# EasyEDA Pro project transmitter by chandan.eprj

# Schematic Transmitter
Board Name: Transmitter; Create Date: 2025-07-05; Page Name: transmitter by poojit; Project Name: transmitter by chandan; Schematic Name: Transmitter; Update Date: 2025-07-13; Add into BOM: yes; Company: Your Company; Convert to PCB: yes; Date: 2025-10-25; Draw By: chandan; REV: 1.0; Sheet: 1/1; spicePre: .
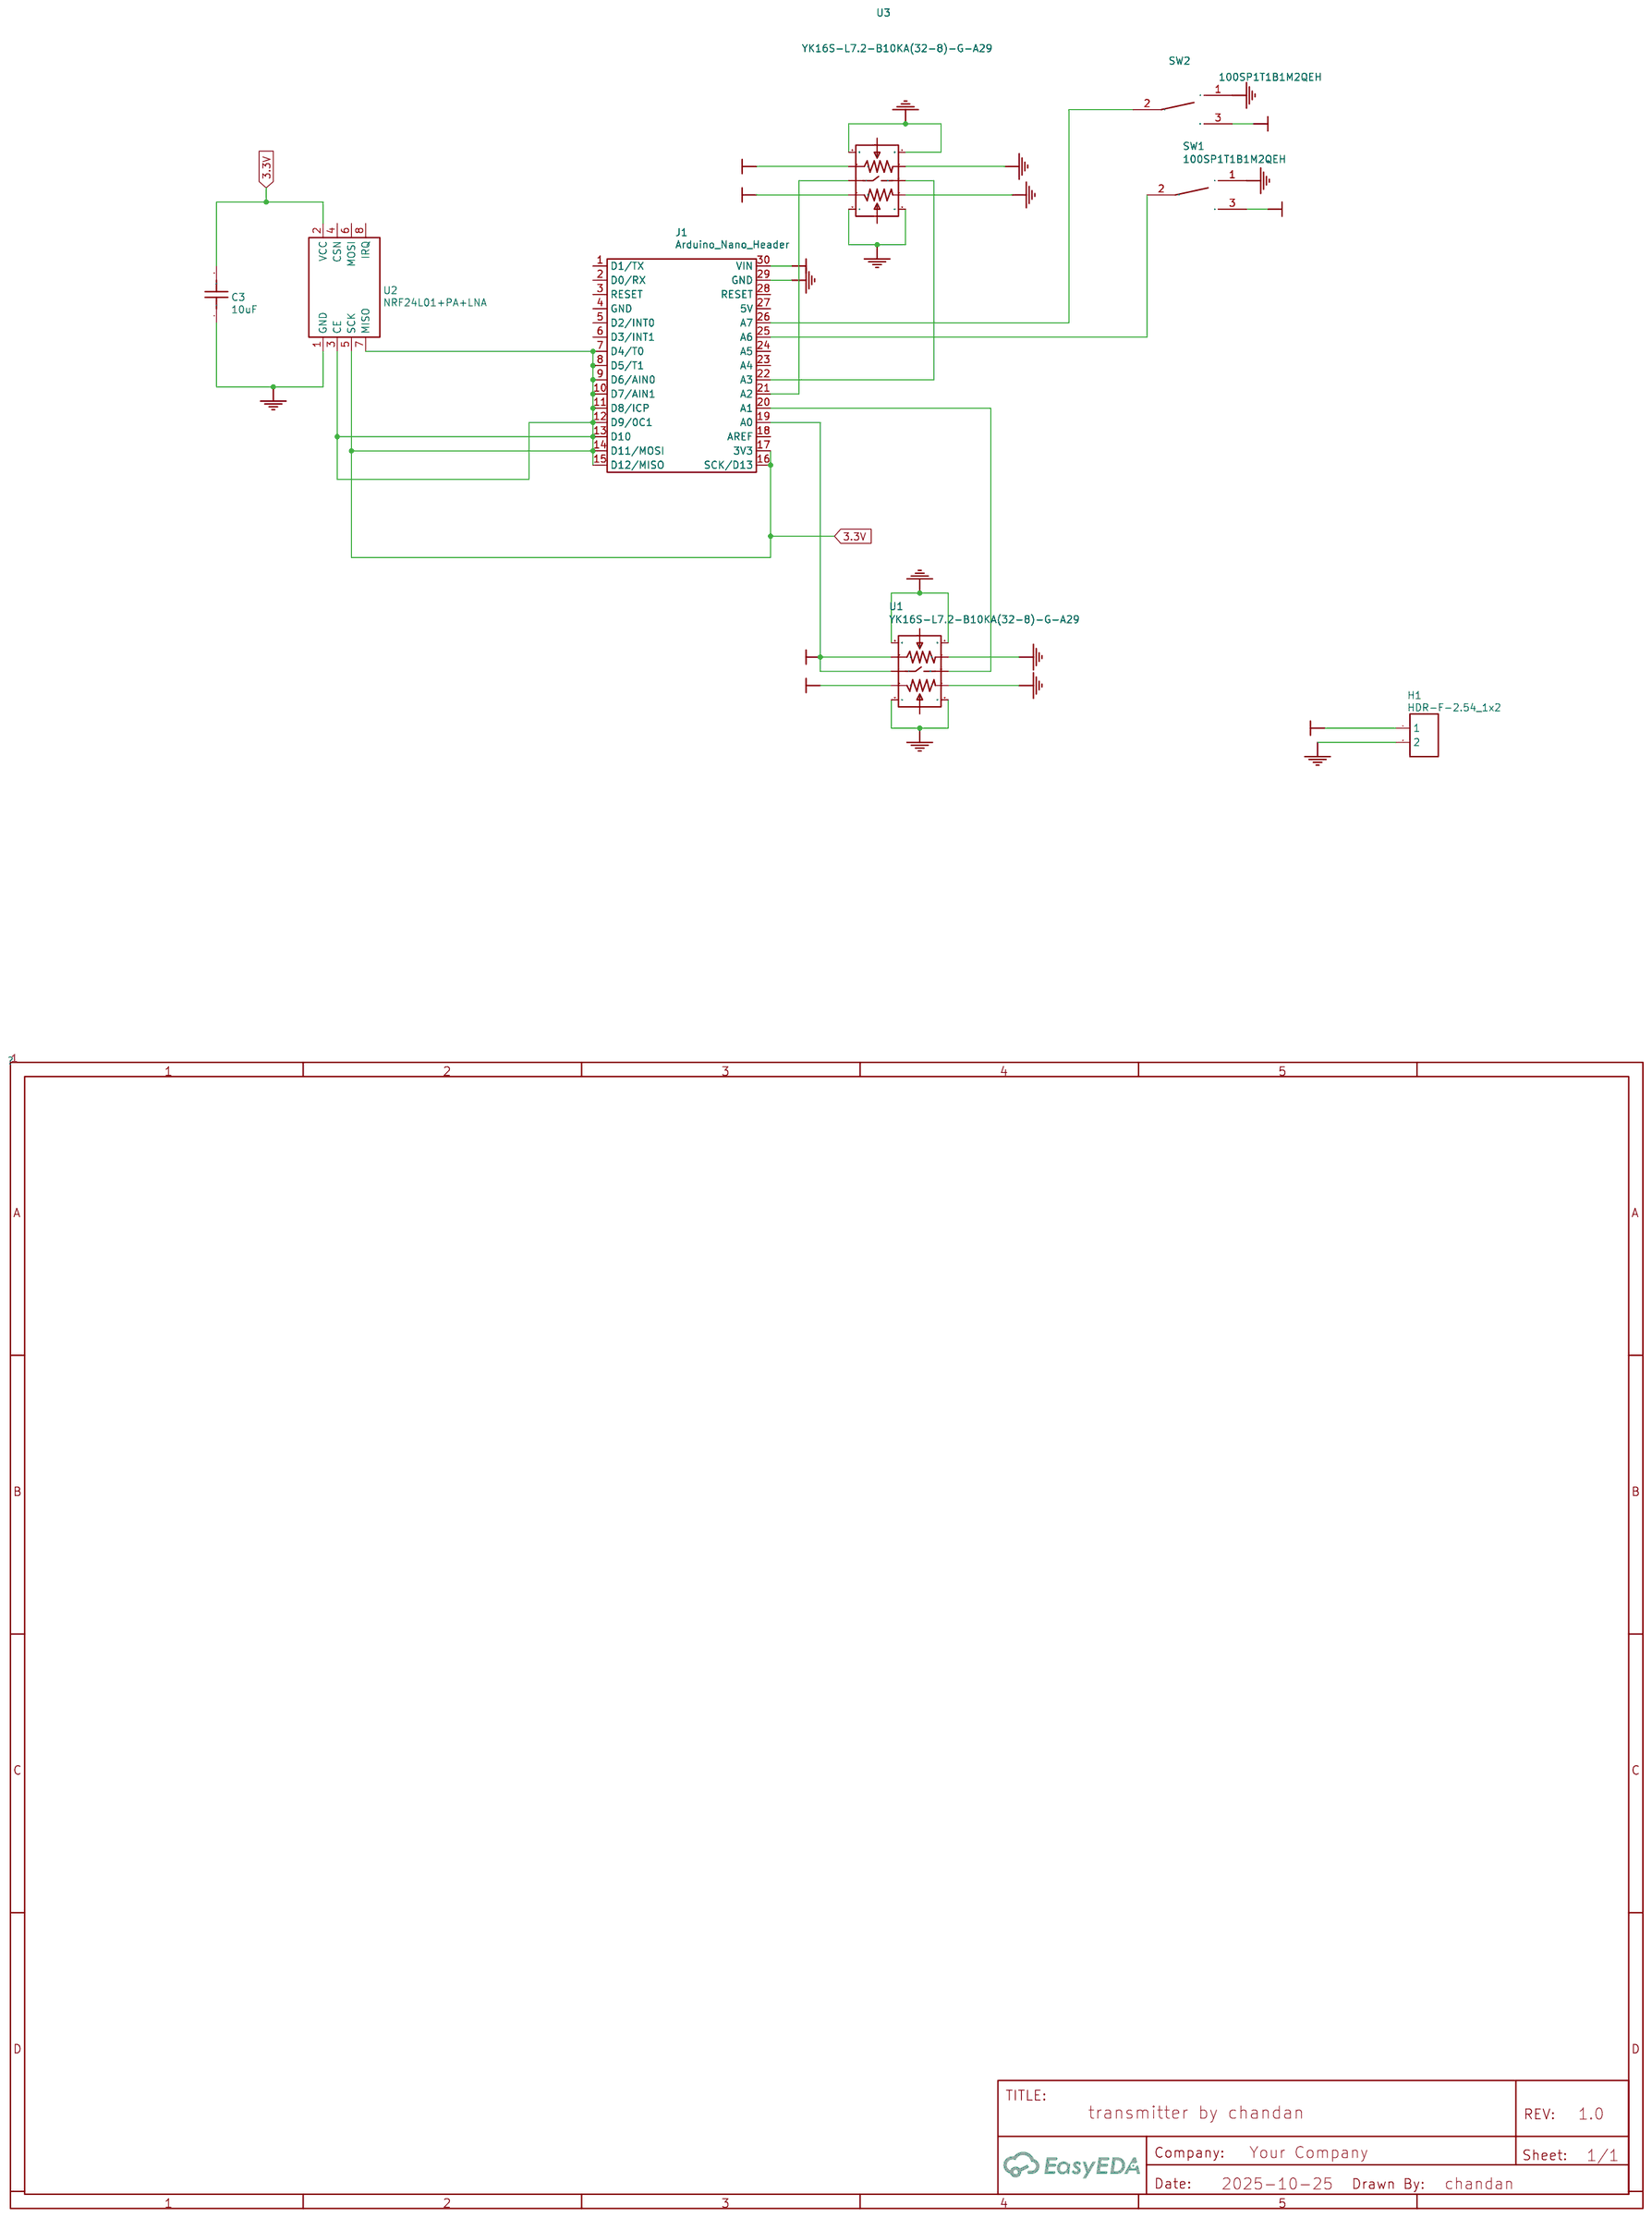
[diagram p0: schematic sheet]

## Parts
C3  10uF
H1  HDR-F-2.54_1x2
J1  Arduino_Nano_Header
SW1  100SP1T1B1M2QEH
SW2  100SP1T1B1M2QEH
U1  YK16S-L7.2-B10KA(32-8)-G-A29
U2  NRF24L01+PA+LNA
U3  YK16S-L7.2-B10KA(32-8)-G-A29

## Library data of the parts
C3 = 10uF: Supplier: LCSC; Supplier Part: C3694130; Manufacturer: TDK; Manufacturer Part: FK16X5R1H105K; Contributor: lcsc; nameAlias: Value; spicePre: C; spiceSymbolName: FK16X5R1H105K
H1 = HDR-F-2.54_1x2: Supplier Part: C49661; Supplier: LCSC; Contributor: LCEDA_Lib; spicePre: H
J1 = Arduino_Nano_Header: spicePre: J
SW1 SW2 = 100SP1T1B1M2QEH: Supplier: LCSC; Supplier Part: C273351; Manufacturer: E-Switch; JLCPCB Part Class: Extended Part; Contributor: LCSC; spicePre: S
U1 U3 = YK16S-L7.2-B10KA(32-8)-G-A29: Supplier: LCSC; Supplier Part: C37323746; Manufacturer: YTL(亚特联); Manufacturer Part: YK16S-L7.2-B10Ka(32-8)-G-A29; JLCPCB Part Class: Extended Part; Contributor: lcsc; spicePre: U
U2 = NRF24L01+PA+LNA: Supplier: LCSC; Supplier Part: C9900187674; Manufacturer: null; Manufacturer Part: nRF24L01+PA+LNA; JLCPCB Part Class: Extended Part; Contributor: lcsc; spicePre: U

## Nets
3.3V: C3.2 J1.7(D4/T0) J1.8(D5/T1) J1.9(D6/AIN0) J1.10(D7/AIN1) J1.11(D8/ICP) J1.12(D9/0C1) J1.13(D10) J1.14(D11/MOSI) J1.15(D12/MISO) J1.16(SCK/D13) J1.17(3V3) U2.2(VCC) U2.3(CE) U2.5(SCK) U2.7(MISO)
+5V: H1.1 J1.19(A0) J1.30(VIN) SW1.3 SW2.3 U1.3 U1.6 U1.7 U3.3 U3.6
GND: C3.1 H1.2 J1.29(GND) SW1.1 SW2.1 U1.1 U1.4 U1.9(shell) U1.10(shell) U1.11(shell) U1.12(shell) U2.1(GND) U3.1 U3.4 U3.9(shell) U3.10(shell) U3.11(shell) U3.12(shell)
Net-(J1-20): J1.20(A1) U1.8
Net-(J1-21): J1.21(A2) U3.7
Net-(J1-22): J1.22(A3) U3.8
Net-(J1-25): J1.25(A6) SW1.2
Net-(J1-26): J1.26(A7) SW2.2

Not connected (* = marked no-connect by the designer): J1 1(D1/TX) 2(D0/RX) 3(RESET) 4(GND) 5(D2/INT0) 6(D3/INT1) 18(AREF) 23(A4) 24(A5) 27(5V) 28(RESET); U1 2 5; U2 4(CSN) 6(MOSI) 8(IRQ); U3 2 5

# Board transmitter by chandan
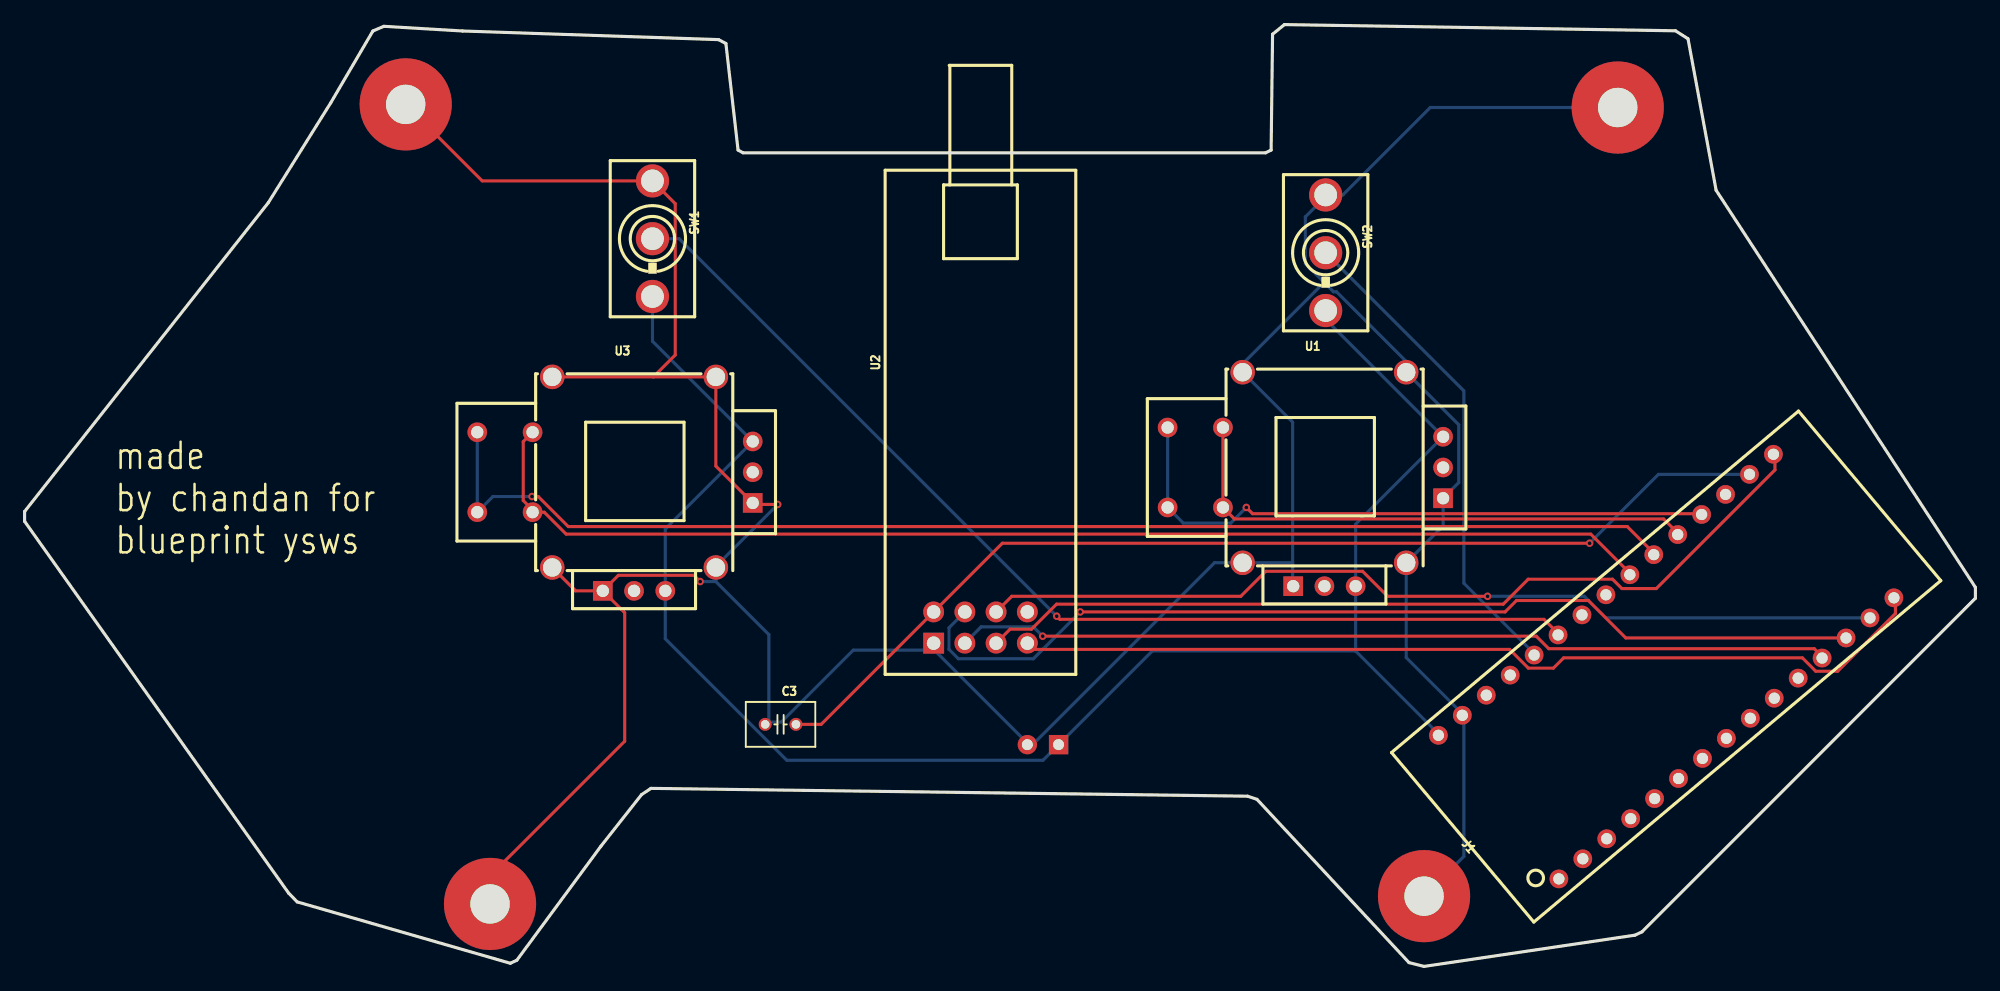
[diagram p1: board, top side]
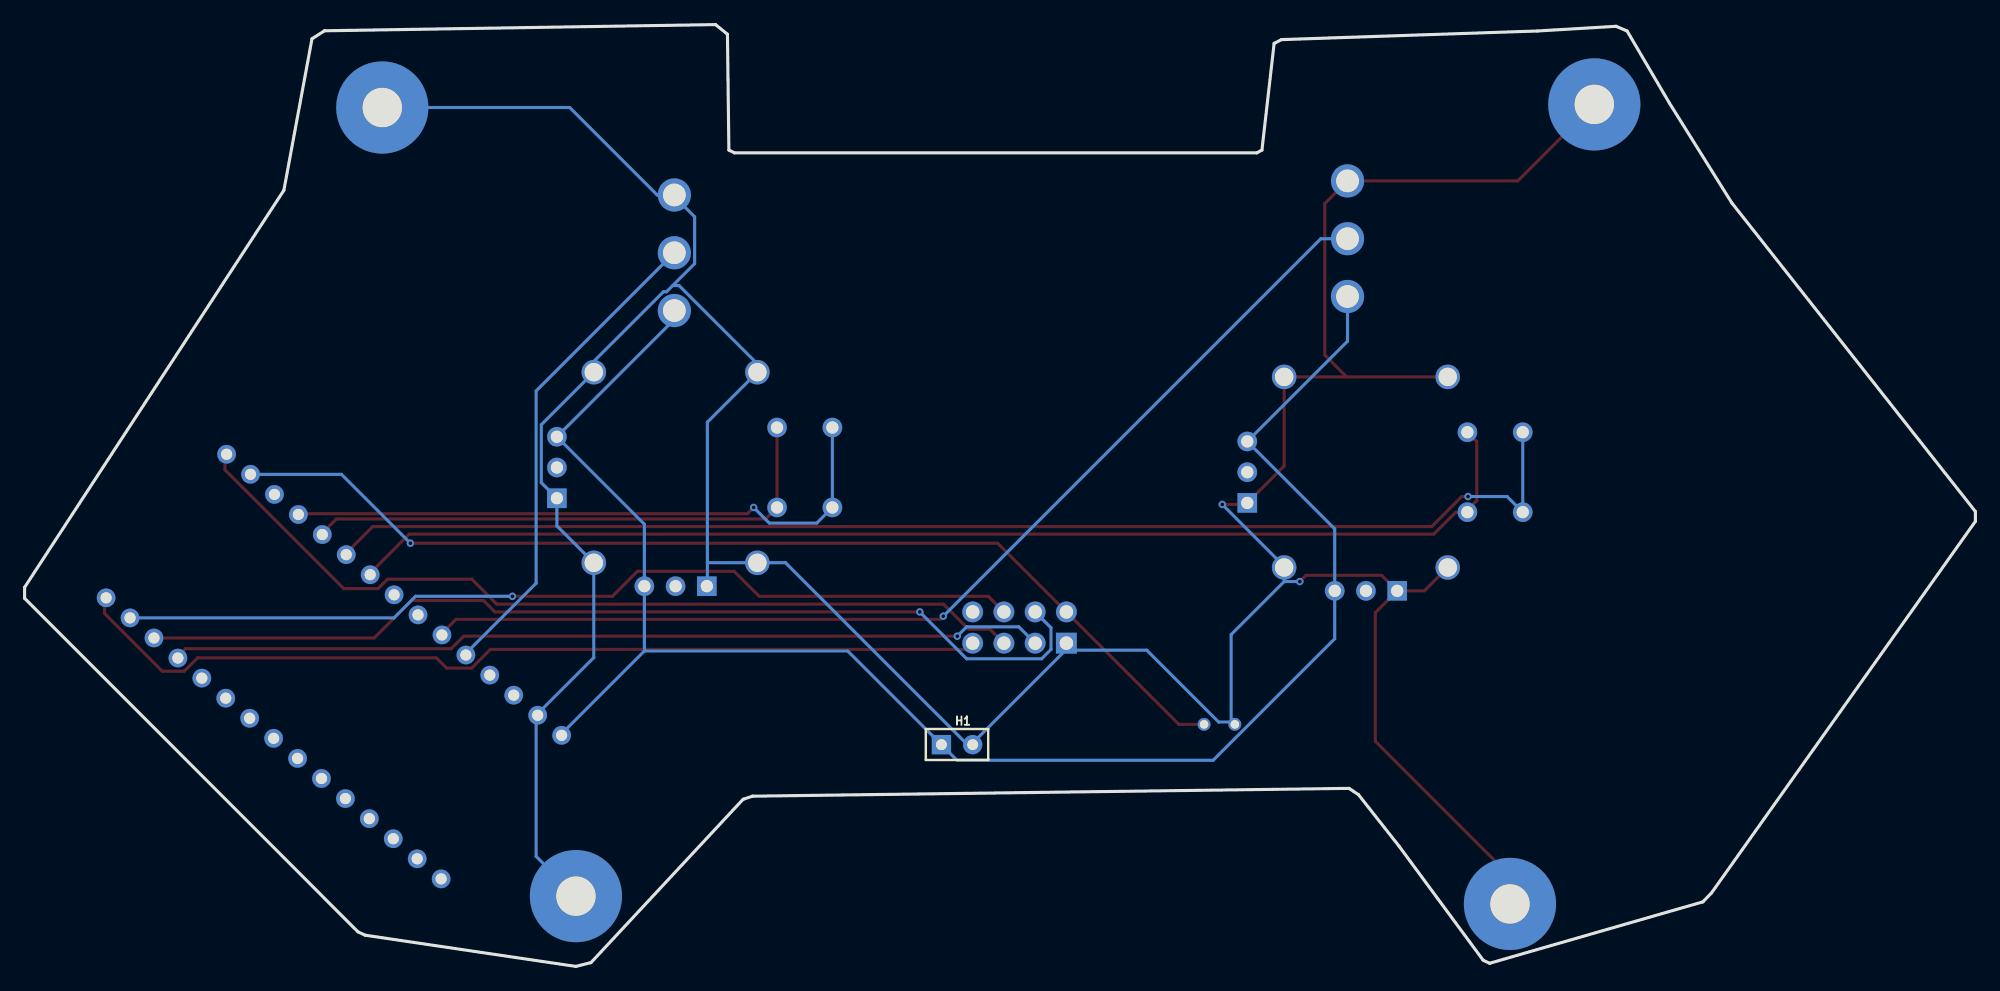
[diagram p2: board, bottom side, seen from below]

Outline 158.62 x 76.59 mm; copper layers: Top Layer, Bottom Layer. Coordinates in mm from the lower left corner of the outline.
Outline path: 0,36.99 0,36.19 21.46,5.97 22.16,5.25 39.5,0.25 40.03,0.5 46.86,9.78 50.16,13.97 50.93,14.48 99.44,13.84 100.2,13.59 112.57,0.31 113.79,0 130.94,2.54 131.51,2.81 158.62,29.94 158.62,30.83 137.54,63.12 135.25,75.44 134.24,76.09 102.44,76.59 101.47,75.81 101.36,66.39 100.91,66.17 58.42,66.17 58.01,66.39 57.02,75.06 56.43,75.37 35.62,76.07 29.21,76.45 28.32,76.07 24.89,70.23 19.81,62.1 0,36.99
Stack: Top Layer 0.035mm / Dielectric1 1.51mm FR4 er 4.5 / Bottom Layer 0.035mm

## Design rules (mm)
spacing Default (default): track to track 0.152, other pairs 0 to 0.152
track width Default (default): min 0.254, default 0.254, max 25.4
differential pair differentialPair (default): width min 0.127, default 0.254, max 2.54; gap min 0.152, default 0.152
via Default (default): diameter min 0.61, default 0.61, max 100.025; hole min 0.305, default 0.305, max 59.995

## Placement (name value [footprint] x y rotation side)
C3  10uF  [CAP-TH_L5.5-W3.5-P2.50-D0.5]  61.47 19.68 0 top
H1  HDR-F-2.54_1x2  [HDR-F-2.54_1X2]  82.8 18.03 180 bottom
J1  Arduino_Nano_Header  [DIP-30_L43.18-W15.24-ARDUINONANO]  133.48 24.38 130 top
NOREF  -  [Pad_e235]  129.54 69.85 0 top
NOREF#2  -  [Pad_e236]  30.99 70.1 0 top
NOREF#3  -  [Pad_e238]  113.79 5.72 0 top
NOREF#4  -  [Pad_e237]  37.85 5.08 0 top
SW1  100SP1T1B1M2QEH  [SW-TH_100SP1T1B1M2QEH]  51.05 59.18 270 top
SW2  100SP1T1B1M2QEH  [SW-TH_100SP1T1B1M2QEH]  105.79 58.04 270 top
U1  YK16S-L7.2-B10KA(32-8)-G-A29  [JOYTICK-TH_YF16S-FL7.2-B5KB-45-10-Y_1]  104.14 39.62 0 top
U2  NRF24L01+PA+LNA  [COMM-TH_L41.0-W15.5-P2.54_NRF24L01]  77.72 27.56 90 top
U3  YK16S-L7.2-B10KA(32-8)-G-A29  [JOYTICK-TH_YF16S-FL7.2-B5KB-45-10-Y_1]  48.01 39.24 0 top

## Footprints (pads in the part's own frame, mm; a bottom-side part is the same pattern mirrored in y, then rotated)
CAP-TH_L5.5-W3.5-P2.50-D0.5
  round 1.05 hole 0.7: 1(-1.25,0) 2(1.25,0)
COMM-TH_L41.0-W15.5-P2.54_NRF24L01
  rect 1.7x1.7 hole 1.1: 1(-1.27,3.81)
  round 1.7 hole 1.1: 2(1.27,3.81) 3(-1.27,1.27) 4(1.27,1.27) 5(-1.27,-1.27) 6(1.27,-1.27) 7(-1.27,-3.81) 8(1.27,-3.81)
DIP-30_L43.18-W15.24-ARDUINONANO
  round 1.524 hole 0.914: 1(-7.62,17.78) 2(-7.62,15.24) 3(-7.62,12.7) 4(-7.62,10.16) 5(-7.62,7.62) 6(-7.62,5.08) 7(-7.62,2.54) 8(-7.62,0) 9(-7.62,-2.54) 10(-7.62,-5.08) 11(-7.62,-7.62) 12(-7.62,-10.16) 13(-7.62,-12.7) 14(-7.62,-15.24) 15(-7.62,-17.78) 16(7.62,-17.78) 17(7.62,-15.24) 18(7.62,-12.7) 19(7.62,-10.16) 20(7.62,-7.62) 21(7.62,-5.08) 22(7.62,-2.54) 23(7.62,0) 24(7.62,2.54) 25(7.62,5.08) 26(7.62,7.62) 27(7.62,10.16) 28(7.62,12.7) 29(7.62,15.24) 30(7.62,17.78)
HDR-F-2.54_1X2
  rect 1.575x1.575 hole 0.889: 1(-1.27,0)
  round 1.575 hole 0.889: 2(1.27,0)
JOYTICK-TH_YF16S-FL7.2-B5KB-45-10-Y_1
  rect 1.6x1.6 hole 1: 1(-0.99,-8.7) 4(11.2,-1.55)
  round 1.6 hole 1: 2(1.55,-8.7) 3(4.09,-8.7) 5(11.2,0.95) 6(11.2,3.45) 7(-11.2,4.2) 7(-11.2,-2.3) 8(-6.7,4.2) 8(-6.7,-2.3)
  round 2 hole 1.5: 9(-5.1,8.7) 10(8.2,8.7) 11(8.2,-6.8) 12(-5.1,-6.8)
Pad_e235
  round 7.5 hole 3.2: 1(0,0)
Pad_e236
  round 7.5 hole 3.2: 1(0,0)
Pad_e237
  round 7.5 hole 3.2: 1(0,0)
Pad_e238
  round 7.5 hole 3.2: 1(0,0)
SW-TH_100SP1T1B1M2QEH
  round 2.7 hole 1.85: 1(-4.7,0) 2(0,0) 3(4.7,0)

## Nets
3.3V: C3.2 J1.17 U2.2
+5V: H1.1 J1.30 SW1.3 SW2.3 U1.3 U1.6 U3.3 U3.6
GND: C3.1 H1.2 J1.29 NOREF.1 NOREF#2.1 NOREF#3.1 NOREF#4.1 SW1.1 SW2.1 U1.1 U1.4 U1.9 U1.10 U1.11 U1.12 U2.1 U3.1 U3.4 U3.9 U3.10 U3.11 U3.12
J1_1: J1.1
J1_2: J1.2
J1_3: J1.3
J1_4: J1.4
J1_5: J1.5
J1_6: J1.6
J1_7: J1.7
J1_8: J1.8
J1_9: J1.9
J1_10: J1.10
J1_11: J1.11
J1_18: J1.18
J1_19: J1.19 U1.7
J1_20: J1.20 U1.8
J1_21: J1.21 U3.7
J1_22: J1.22 U3.8
J1_23: J1.23
J1_24: J1.24
J1_25: J1.25 SW1.2
J1_26: J1.26 SW2.2
J1_27: J1.27
J1_28: J1.28
U1_2: U1.2
U1_5: U1.5
U2_3: J1.12 U2.3
U2_4: J1.13 U2.4
U2_5: J1.16 U2.5
U2_6: J1.14 U2.6
U2_7: J1.15 U2.7
U2_8: U2.8
U3_2: U3.2
U3_5: U3.5

## Via types
v1: diameter 0.61, hole 0.305, Top Layer to Bottom Layer, 9 vias

## Routing (per net, layer and track width the routed paths; a pad name or vN(x,y) marks a point on that pad's centre or on a via; arc(x,y) is an arc through that point)
3.3V: length 86.1
  Top Layer w0.254: v1(127.25,34.42) 79.5,34.42 U2.2 64.77,19.68 C3.2
  Bottom Layer w0.254: 140.38,40.02 132.85,40.02 v1(127.25,34.42)
+5V: length 142.4
  Bottom Layer w0.254: SW2.3 105.79,52.62 U1.6 108.23,35.96 U1.3 ; 108.23,25.65 108.23,30.92 ; 108.23,25.65 115.09,18.79 ; 108.23,25.65 91.69,25.65 H1.1 82.8,16.76 61.98,16.76 52.1,26.64 U3.3 52.1,35.58 U3.6 51.05,50.84 51.05,54.48
GND: length 312.8
  Top Layer w0.254: NOREF#2.1 37.21,63.88 SW1.1 52.9,62.03 52.9,49.72 51.13,47.94 ; 36.45,7.11 37.59,7.11 48.79,18.31 48.79,28.77 U3.1 ; U3.1 48.28,31.81 54.43,31.81 v1(54.94,31.3) ; U3.1 44.81,30.54 U3.12 ; 51.13,47.94 U3.10 56.21,40.69 U3.4 59.33,37.57 v1(61.24,37.57) ; 51.13,47.94 U3.9
  Bottom Layer w0.254: 105.92,55.37 106.43,54.86 106.68,54.86 112.34,49.2 U1.10 116.61,44.05 116.61,39.34 U1.4 115.34,35.82 U1.11 112.34,25.12 117.03,20.42 117.03,8.95 NOREF#3.1 ; 105.92,55.37 104.14,57.15 104.14,60.96 105.92,62.74 ; 105.92,55.37 105.41,55.37 99.06,49.02 99.06,48.34 U1.9 103.1,44.26 103.1,32.83 ; v1(61.24,37.57) 56.21,32.54 U3.11 56.21,31.3 ; U1.12 99.04,32.83 103.1,32.83 ; 103.1,32.83 103.1,30.97 U1.1 ; 81.6,18.1 82.02,18.1 96.75,32.83 99.04,32.83 ; 81.6,18.1 73.98,25.72 ; 81.6,18.1 H1.2 ; 60.52,19.88 60.41,19.88 C3.1 ; 60.52,19.88 60.52,26.99 56.21,31.3 ; 60.52,19.88 61.53,19.88 67.37,25.72 73.98,25.72 ; U2.1 73.98,26.22 73.98,25.72 ; 56.21,31.3 v1(54.94,31.3) ; SW2.1 107.19,62.74 114.3,69.85 NOREF.1
J1_19: length 51.3
  Top Layer w0.254: v1(99.34,37.32) 99.85,36.82 136.43,36.82 136.49,36.75
  Bottom Layer w0.254: v1(99.34,37.32) 98.07,36.05 94.21,36.05 U1.7 U1.7
J1_20: length 44.5
  Top Layer w0.254: U1.8 U1.8 98.37,36.39 133.27,36.39 134.54,35.12
J1_21: length 104.8
  Top Layer w0.254: 132.6,33.49 130.31,35.77 44.21,35.77 41.77,38.21 v1(41.26,38.21)
  Bottom Layer w0.254: U3.7 U3.7 38.08,38.21 v1(41.26,38.21)
J1_22: length 98.7
  Top Layer w0.254: 130.65,31.85 127.35,35.16 44.04,35.16 42.26,36.93 41.5,36.93 ; 41.5,36.93 U3.8 ; 41.5,36.93 40.54,37.89 40.54,42.68 U3.8
J1_25: length 87.1
  Top Layer w0.254: 124.81,26.96 123.54,28.23 84.17,28.23 v1(83.92,28.48)
  Bottom Layer w0.254: SW1.2 53.22,59.18 v1(83.92,28.48)
J1_26: length 39.8
  Bottom Layer w0.254: 122.87,25.32 117.03,31.16 117.03,46.8 SW2.2
U2_3: length 71.4
  Top Layer w0.254: 146.29,25.08 145.52,25.84 123.93,25.84 122.92,26.86 v1(82.79,26.86)
  Bottom Layer w0.254: v1(82.79,26.86) 82.02,27.62 77.78,27.62 U2.3
U2_4: length 80.2
  Top Layer w0.254: 148.23,26.71 130.2,26.71 127.15,29.76 121.31,29.76 120.38,28.83 v1(85.83,28.83)
  Bottom Layer w0.254: U2.4 75.17,27.54 75.17,25.78 75.93,25.02 82.02,25.02 v1(85.83,28.83)
U2_5: length 71.1
  Top Layer w0.254: 142.33,41.65 142.33,40.38 132.67,30.73 129.88,30.73 129.12,31.49 122.26,31.49 120.23,29.46 83.91,29.46 81.87,27.43 80.13,27.43 U2.5
U2_6: length 74.1
  Top Layer w0.254: v1(118.96,30.1) 110.83,30.1 108.8,32.13 100.92,32.13 98.89,30.1 80.26,30.1 U2.6
  Bottom Layer w0.254: v1(118.96,30.1) 126.83,30.1 128.59,28.34 150.18,28.34
U2_7: length 75.4
  Top Layer w0.254: U2.7 82.04,25.78 120.75,25.78 122.27,24.26 124.31,24.26 125.14,25.09 144.55,25.09 145.64,24 147.42,24 152.12,28.71 152.12,29.98

## Text on the board
Top Silkscreen Layer: made / by chandan for / blueprint ysws
